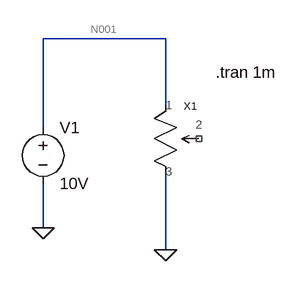
[diagram p0: schematic Draft2.asc]
Draft2.asc, the LTspice schematic file:
Version 4
SHEET 1 880 748
WIRE 208 0 32 0
WIRE 208 96 208 0
WIRE 32 128 32 0
WIRE 32 272 32 208
WIRE 208 304 208 192
FLAG 32 272 0
FLAG 208 304 0
SYMBOL voltage 32 112 R0
SYMATTR InstName V1
SYMATTR Value 10V
SYMBOL pot_ckh 192 96 R0
SYMATTR InstName X1
TEXT 280 48 Left 2 !.tran 1m

The netlist it stands for:
* Draft2.asc
V1 N001 0 10V
XX1 N001 NC_01 0 pot_ckh R=20k wiper=0.5  ; pins 1 2 3
.tran 1m
.lib Pot_ckh.asc
.backanno
.end

* Results of the author's LTspice run, read from the files saved beside the schematic
* Operating Point, zero values left out:
*   V(n001) = 10 V
*   I(V1) = -500 µA
*   Ix(x1:1) = 500 µA
*   Ix(x1:3) = -500 µA